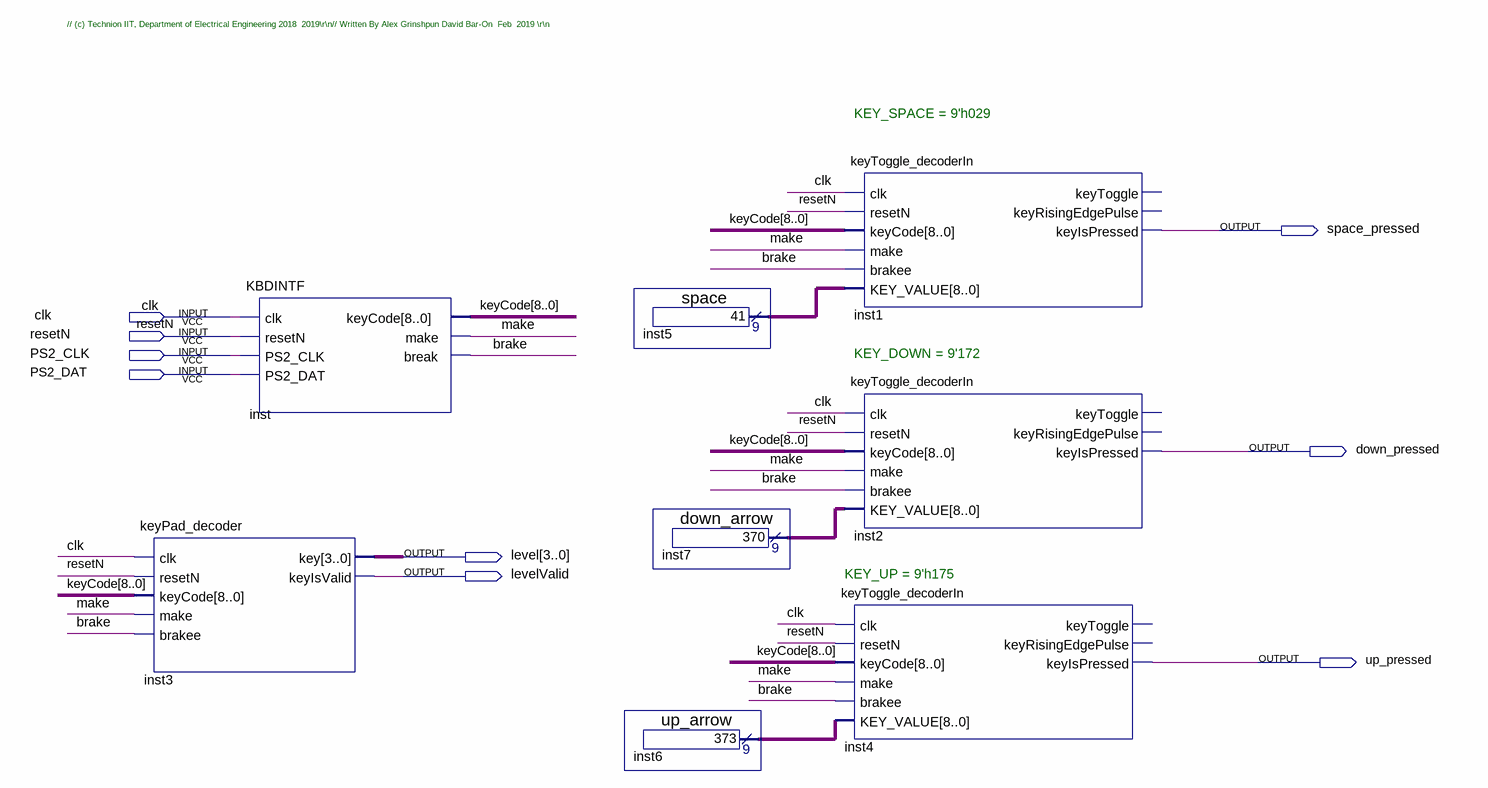
[diagram p0: schematic sheet]
// Quartus schematic TOP_KBD_DEMOLPM.bdf as structural Verilog: 8 symbols, 9 pins
module TOP_KBD_DEMOLPM (
  input  clk,
  input  resetN,
  input  PS2_CLK,
  input  PS2_DAT,
  output space_pressed,
  output down_pressed,
  output [3:0] level,
  output levelValid,
  output up_pressed
);

  wire brake, make;
  wire [8:0] inst5_result, inst6_result, inst7_result, keyCode;

  keyPad_decoder inst3 (
    .clk(clk), .resetN(resetN), .keyCode(keyCode), .make(make), .brakee(brake), .key(level),
    .keyIsValid(levelValid));
  KBDINTF inst (
    .clk(clk), .resetN(resetN), .PS2_CLK(PS2_CLK), .PS2_DAT(PS2_DAT), .keyCode(keyCode), .make(make),
    .\break (brake));
  space inst5 (.result(inst5_result));
  up_arrow inst6 (.result(inst6_result));
  down_arrow inst7 (.result(inst7_result));
  keyToggle_decoderIn inst1 (
    .clk(clk), .resetN(resetN), .keyCode(keyCode), .make(make), .brakee(brake), .KEY_VALUE(inst5_result),
    .keyIsPressed(space_pressed));  // open: keyToggle, keyRisingEdgePulse
  keyToggle_decoderIn inst2 (
    .clk(clk), .resetN(resetN), .keyCode(keyCode), .make(make), .brakee(brake), .KEY_VALUE(inst7_result),
    .keyIsPressed(down_pressed));  // open: keyToggle, keyRisingEdgePulse
  keyToggle_decoderIn inst4 (
    .clk(clk), .resetN(resetN), .keyCode(keyCode), .make(make), .brakee(brake), .KEY_VALUE(inst6_result),
    .keyIsPressed(up_pressed));  // open: keyToggle, keyRisingEdgePulse

  // Notes on the sheet:
  //   // (c) Technion IIT, Department of Electrical Engineering 2018  2019\r\n// Written By Alex Grinshpun David Bar-On  Feb  2019 \r\n
  //   KEY_SPACE = 9'h029
  //   KEY_DOWN = 9'172
  //   KEY_UP = 9'h175
endmodule
